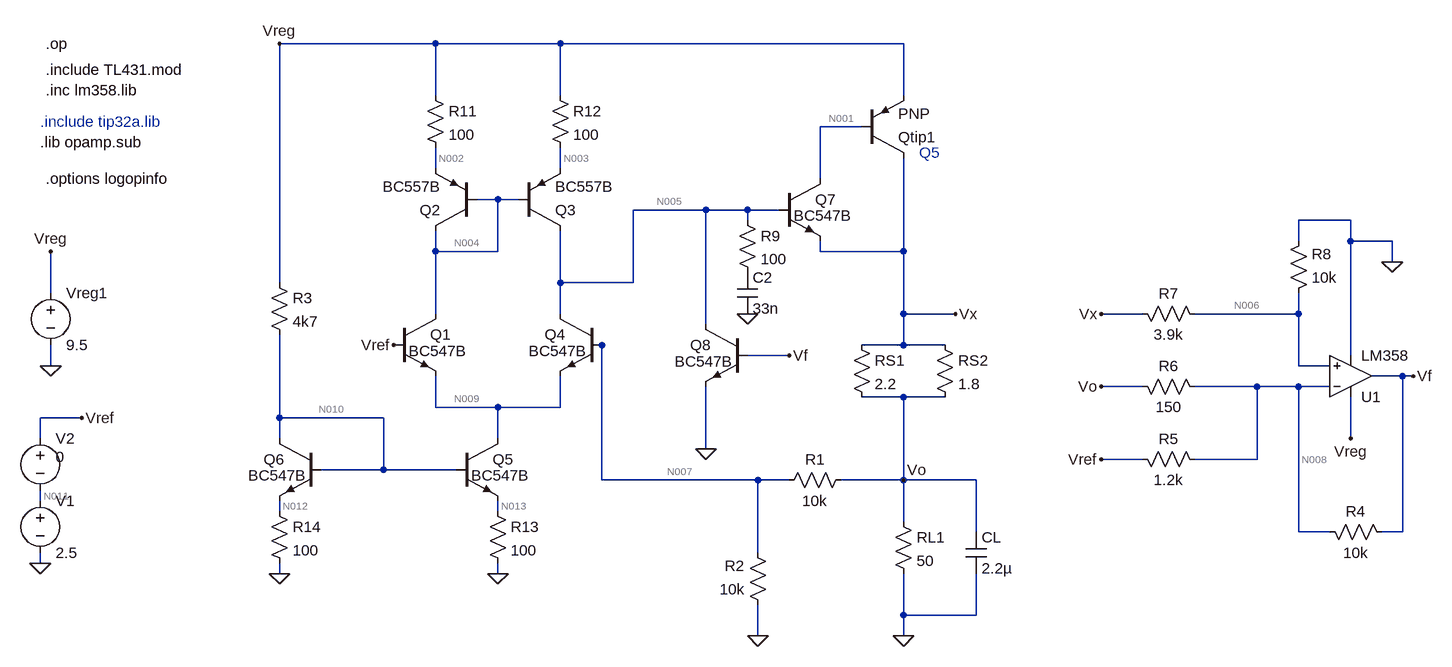
[diagram p0: schematic Analisis_termico.asc]
Analisis_termico.asc, the LTspice schematic file:
Version 4.1
SHEET 1 1620 680
WIRE -192 -368 -432 -368
WIRE 0 -368 -192 -368
WIRE 528 -368 0 -368
WIRE -192 -288 -192 -368
WIRE 0 -288 0 -368
WIRE 528 -288 528 -368
WIRE 464 -240 400 -240
WIRE -192 -176 -192 -208
WIRE 0 -176 0 -208
WIRE 400 -160 400 -240
WIRE -96 -128 -128 -128
WIRE -64 -128 -96 -128
WIRE 224 -112 112 -112
WIRE 288 -112 224 -112
WIRE 336 -112 288 -112
WIRE 288 -96 288 -112
WIRE 1216 -96 1136 -96
WIRE 1136 -64 1136 -96
WIRE 1216 -64 1216 -96
WIRE 1280 -64 1216 -64
WIRE -192 -48 -192 -80
WIRE -96 -48 -96 -128
WIRE -96 -48 -192 -48
WIRE 400 -48 400 -64
WIRE 528 -48 528 -192
WIRE 528 -48 400 -48
WIRE 1280 -32 1280 -64
WIRE -432 0 -432 -368
WIRE 0 0 0 -80
WIRE 112 0 112 -112
WIRE 112 0 0 0
WIRE -784 16 -784 -48
WIRE -192 48 -192 -48
WIRE 0 48 0 0
WIRE 528 48 528 -48
WIRE 608 48 528 48
WIRE 896 48 832 48
WIRE 1136 48 1136 16
WIRE 1136 48 976 48
WIRE 224 64 224 -112
WIRE 64 96 48 96
WIRE 528 96 528 48
WIRE 528 96 464 96
WIRE 592 96 528 96
WIRE 352 112 288 112
WIRE 1216 112 1216 -64
WIRE -784 128 -784 96
WIRE 1136 128 1136 48
WIRE 1184 128 1136 128
WIRE 1296 144 1248 144
WIRE 1312 144 1296 144
WIRE 896 160 832 160
WIRE 1072 160 976 160
WIRE 1136 160 1072 160
WIRE 1184 160 1136 160
WIRE 528 176 464 176
WIRE 592 176 528 176
WIRE -192 192 -192 144
WIRE -96 192 -192 192
WIRE 0 192 0 144
WIRE 0 192 -96 192
WIRE -736 208 -800 208
WIRE -432 208 -432 80
WIRE -272 208 -432 208
WIRE -800 240 -800 208
WIRE -432 240 -432 208
WIRE -96 240 -96 192
WIRE 1216 240 1216 176
WIRE 224 256 224 160
WIRE 896 272 832 272
WIRE 1072 272 1072 160
WIRE 1072 272 976 272
WIRE -272 288 -272 208
WIRE -272 288 -368 288
WIRE -160 288 -272 288
WIRE 64 304 64 96
WIRE 304 304 64 304
WIRE 352 304 304 304
WIRE 528 304 528 176
WIRE 528 304 432 304
WIRE 640 304 528 304
WIRE -800 336 -800 320
WIRE -432 352 -432 336
WIRE -96 352 -96 336
WIRE 528 368 528 304
WIRE 640 384 640 304
WIRE 1136 384 1136 160
WIRE 1184 384 1136 384
WIRE 1296 384 1296 144
WIRE 1296 384 1264 384
WIRE 304 416 304 304
WIRE -800 432 -800 416
WIRE -432 448 -432 432
WIRE -96 448 -96 432
WIRE 528 512 528 448
WIRE 640 512 640 448
WIRE 640 512 528 512
WIRE 304 544 304 496
WIRE 528 544 528 512
FLAG -96 448 0
FLAG -432 448 0
FLAG 528 544 0
FLAG 304 544 0
FLAG -256 96 Vref
FLAG -784 128 0
FLAG -784 -48 Vreg
FLAG -432 -368 Vreg
FLAG 528 304 Vo
FLAG 608 48 Vx
FLAG 224 256 0
FLAG 352 112 Vf
FLAG 1312 144 Vf
FLAG 832 272 Vref
FLAG 832 160 Vo
FLAG 832 48 Vx
FLAG 1216 240 Vreg
FLAG -800 432 0
FLAG -736 208 Vref
FLAG 1280 -32 0
FLAG 288 48 0
SYMBOL npn -256 48 R0
WINDOW 3 23 57 Left 2
SYMATTR Value BC547B
SYMATTR InstName Q1
SYMBOL pnp -128 -80 R180
SYMATTR InstName Q2
SYMATTR Value BC557B
SYMBOL res 448 288 R90
WINDOW 0 0 56 VBottom 2
WINDOW 3 32 56 VTop 2
SYMATTR InstName R1
SYMATTR Value 10k
SYMBOL res 320 512 R180
WINDOW 0 36 76 Left 2
WINDOW 3 36 40 Left 2
SYMATTR InstName R2
SYMATTR Value 10k
SYMBOL res -448 -16 R0
SYMATTR InstName R3
SYMATTR Value 4k7
SYMBOL voltage -784 0 R0
WINDOW 123 0 0 Left 0
WINDOW 39 0 0 Left 0
SYMATTR InstName Vreg1
SYMATTR Value 9.5
SYMBOL res 512 352 R0
SYMATTR InstName RL1
SYMATTR Value 50
SYMBOL pnp 464 -192 M180
SYMATTR InstName Qtip1
SYMBOL res 448 80 R0
SYMATTR InstName RS1
SYMATTR Value 2.2
SYMBOL res 1280 400 M270
WINDOW 0 32 56 VTop 2
WINDOW 3 0 56 VBottom 2
SYMATTR InstName R4
SYMATTR Value 10k
SYMBOL res 992 288 M270
WINDOW 0 32 56 VTop 2
WINDOW 3 0 56 VBottom 2
SYMATTR InstName R5
SYMATTR Value 1.2k
SYMBOL res 992 176 M270
WINDOW 0 32 56 VTop 2
WINDOW 3 0 56 VBottom 2
SYMATTR InstName R6
SYMATTR Value 150
SYMBOL res 992 64 M270
WINDOW 0 32 56 VTop 2
WINDOW 3 0 56 VBottom 2
SYMATTR InstName R7
SYMATTR Value 3.9k
SYMBOL res 1120 32 M180
WINDOW 0 36 76 Left 2
WINDOW 3 36 40 Left 2
SYMATTR InstName R8
SYMATTR Value 10k
SYMBOL OpAmps\\opamp2 1216 208 M180
SYMATTR InstName U1
SYMATTR Value LM358
SYMBOL pnp -64 -80 M180
SYMATTR InstName Q3
SYMATTR Value BC557B
SYMBOL npn 64 48 M0
WINDOW 3 23 57 Left 2
SYMATTR Value BC547B
SYMATTR InstName Q4
SYMBOL npn -160 240 R0
WINDOW 3 23 57 Left 2
SYMATTR Value BC547B
SYMATTR InstName Q5
SYMBOL npn -368 240 M0
WINDOW 3 23 57 Left 2
SYMATTR Value BC547B
SYMATTR InstName Q6
SYMBOL npn 336 -160 R0
WINDOW 3 23 57 Left 2
SYMATTR Value BC547B
SYMATTR InstName Q7
SYMBOL npn 288 64 M0
WINDOW 3 23 57 Left 2
SYMATTR Value BC547B
SYMATTR InstName Q8
SYMBOL res -112 336 R0
SYMATTR InstName R13
SYMATTR Value 100
SYMBOL res -448 336 R0
SYMATTR InstName R14
SYMATTR Value 100
SYMBOL res -208 -304 R0
SYMATTR InstName R11
SYMATTR Value 100
SYMBOL res -16 -304 R0
SYMATTR InstName R12
SYMATTR Value 100
SYMBOL voltage -800 320 R0
WINDOW 123 0 0 Left 0
WINDOW 39 0 0 Left 0
SYMATTR InstName V1
SYMATTR Value 2.5
SYMBOL cap 272 -16 R0
SYMATTR InstName C2
SYMATTR Value 33n
SYMBOL voltage -800 224 R0
WINDOW 123 0 0 Left 0
WINDOW 39 0 0 Left 0
WINDOW 3 24 44 Left 2
SYMATTR InstName V2
SYMATTR Value 0
SYMBOL cap 624 384 R0
SYMATTR InstName CL
SYMATTR Value 2.2µ
SYMBOL res 272 -112 R0
SYMATTR InstName R9
SYMATTR Value 100
SYMBOL res 576 80 R0
SYMATTR InstName RS2
SYMATTR Value 1.8
TEXT -800 -248 Left 2 ;.include tip32a.lib
TEXT -800 -216 Left 2 !.lib opamp.sub
TEXT -792 -296 Left 2 !.inc lm358.lib
TEXT -792 -328 Left 2 !.include TL431.mod
TEXT 552 -200 Left 2 ;Q5
TEXT -792 -368 Left 2 !.op
TEXT -792 -160 Left 2 !.options logopinfo

The netlist it stands for:
* Analisis_termico.asc
Q1 N004 Vref N009 0 BC547B
Q2 N004 N004 N002 0 BC557B
R1 Vo N007 10k
R2 0 N007 10k
R3 Vreg N010 4k7
Vreg1 Vreg 0 9.5
RL1 Vo 0 50
Qtip1 Vx N001 Vreg 0 PNP
RS1 Vx Vo 2.2
R4 Vf N008 10k
R5 N008 Vref 1.2k
R6 N008 Vo 150
R7 N006 Vx 3.9k
R8 N006 0 10k
X§U1 N006 N008 Vreg 0 Vf LM358  ; pins In+ In- V+ V- OUT
Q3 N005 N004 N003 0 BC557B
Q4 N005 N007 N009 0 BC547B
Q5 N009 N010 N013 0 BC547B
Q6 N010 N010 N012 0 BC547B
Q7 N001 N005 Vx 0 BC547B
Q8 N005 Vf 0 0 BC547B
R13 N013 0 100
R14 N012 0 100
R11 Vreg N002 100
R12 Vreg N003 100
V1 N011 0 2.5
C2 P001 0 33n
V2 Vref N011 0
CL Vo 0 2.2µ
R9 N005 P001 100
RS2 Vx Vo 1.8
.model NPN NPN
.model PNP PNP
.lib standard.bjt
* .include tip32a.lib
.lib opamp.sub
.inc lm358.lib
.include TL431.mod
* Q5
.op
.options logopinfo
.backanno
.end

* Results of the author's LTspice run, read from the files saved beside the schematic
* Operating Point:
*   V(vref) = 2.5 V
*   V(n002) = 9.41 V
*   V(vo) = 5.035 V
*   V(vreg) = 9.5 V
*   V(n001) = 8.606 V
*   V(n008) = 4.691 V
*   V(n006) = 3.699 V
*   V(n003) = 9.407 V
*   V(n011) = 2.5 V
*   V(n004) = 8.786 V
*   V(n009) = 1.866 V
*   V(n007) = 2.502 V
*   V(n010) = 838.9 mV
*   V(vx) = 5.137 V
*   V(vf) = 70.27 mV
*   V(n005) = 5.775 V
*   V(n013) = 184 mV
*   V(n012) = 183.6 mV
*   V(p001) = 5.775 V
*   I(Vreg1) = -107.2 mA
*   I(R5) = 1.826 mA
*   I(CL) = 0 A
*   Ic(Q1) = 904.3 µA
*   Ib(Q1) = 2.904 µA
*   Ie(Q1) = -907.2 µA
*   Is(Q1) = 0 A
*   I(R8) = 369.9 µA
*   Ic(Q5) = 1.834 mA
*   Ib(Q5) = 6.421 µA
*   Ie(Q5) = -1.84 mA
*   Is(Q5) = 0 A
*   Ic(Q8) = 6.156 pA
*   Ib(Q8) = -5.682 pA
*   Ie(Q8) = -473.5 fA
*   Is(Q8) = 0 A
*   I(V1) = 1.823 mA
*   I(R1) = 253.3 µA
*   Ic(Qtip1) = -102.6 mA
*   Ib(Qtip1) = -1.026 mA
*   Ie(Qtip1) = 103.6 mA
*   Is(Qtip1) = 0 A
*   I(R3) = 1.843 mA
*   I(R7) = -368.8 µA
*   Ic(Q7) = 1.026 mA
*   Ib(Q7) = 3.474 µA
*   Ie(Q7) = -1.029 mA
*   Is(Q7) = 0 A
*   I(R14) = 1.836 mA
*   I(RS2) = 56.78 mA
*   I(V2) = 1.823 mA
*   I(R12) = 929.4 µA
*   Ic(Q2) = -899 µA
*   Ib(Q2) = -2.779 µA
*   Ie(Q2) = 901.8 µA
*   Is(Q2) = 0 A
*   I(R4) = -462.1 µA
*   I(R13) = 1.84 mA
*   I(R9) = 0 A
*   I(RL1) = 100.7 mA
*   Ic(Q4) = 923.4 µA
*   Ib(Q4) = 3.104 µA
*   Ie(Q4) = -926.5 µA
*   Is(Q4) = 0 A
*   I(R2) = -250.2 µA
*   I(RS1) = 46.45 mA
*   I(R6) = -2.289 mA
*   I(R11) = 901.8 µA
*   Ic(Q3) = -926.9 µA
*   Ib(Q3) = -2.501 µA
*   Ie(Q3) = 929.4 µA
*   Is(Q3) = 0 A
*   Ic(Q6) = 1.83 mA
*   Ib(Q6) = 6.515 µA
*   Ie(Q6) = -1.836 mA
*   Is(Q6) = 0 A
*   I(C2) = 0 A
*   Ix(u1:1) = -1.088 µA
*   Ix(u1:2) = 997.6 nA
*   Ix(u1:99) = -94.55 µA
*   Ix(u1:50) = -367.4 µA
*   Ix(u1:28) = 462.1 µA
* From the log:
*   Semiconductor Device Operating Points:
*                           --- Diodes ---
*   Name:     u1:D1       u1:D2       u1:D5       u1:D3       u1:D6
*   Model:      dx          dx          dx          dx          dx
*   Id:     -7.87e-12    5.10e-05    4.64e-04   -3.44e-13    2.25e-06
*   Vd:     -7.87e+00    6.38e-01    6.95e-01   -3.43e-01    5.57e-01
*   Req:     1.00e+12    5.07e+02    5.57e+01    1.00e+12    1.15e+04
*   CAP:     0.00e+00    0.00e+00    0.00e+00    0.00e+00    0.00e+00
*   Name:     u1:D4
*   Model:      dx
*   Id:     -1.98e-13
*   Vd:     -1.97e-01
*   Req:     1.00e+12
*   CAP:     0.00e+00
*                           --- Bipolar Transistors ---
*   Name:      Qtip1         Q1          Q4          Q5          Q6
*   Model:      pnp        bc547b      bc547b      bc547b      bc547b
*   Ib:      -1.03e-03    2.90e-06    3.10e-06    6.42e-06    6.52e-06
*   Ic:      -1.03e-01    9.04e-04    9.23e-04    1.83e-03    1.83e-03
*   Vbe:     -8.94e-01    6.34e-01    6.35e-01    6.55e-01    6.55e-01
*   Vbc:      3.47e+00   -6.29e+00   -3.27e+00   -1.03e+00    0.00e+00
*   Vce:     -4.36e+00    6.92e+00    3.91e+00    1.68e+00    6.55e-01
*   BetaDC:   1.00e+02    3.11e+02    2.97e+02    2.86e+02    2.81e+02
*   Gm:       3.97e+00    3.44e-02    3.51e-02    6.93e-02    6.91e-02
*   Rpi:      2.52e+01    9.01e+03    8.43e+03    4.07e+03    4.01e+03
*   Rx:       0.00e+00    1.00e+00    1.00e+00    1.00e+00    1.00e+00
*   Ro:       4.62e+72    7.51e+04    7.03e+04    3.42e+04    3.37e+04
*   Cbe:      0.00e+00    5.84e-11    5.95e-11    8.33e-11    8.34e-11
*   Cbc:      0.00e+00    1.00e-12    1.20e-12    1.59e-12    2.31e-12
*   Cjs:      0.00e+00    0.00e+00    0.00e+00    0.00e+00    0.00e+00
*   BetaAC:   1.00e+02    3.10e+02    2.96e+02    2.82e+02    2.77e+02
*   Cbx:      0.00e+00    6.17e-13    7.37e-13    9.75e-13    1.42e-12
*   Ft:       0.00e+00    9.13e+07    9.10e+07    1.28e+08    1.26e+08
*   Name:        Q7          Q8          Q2          Q3        u1:Q1
*   Model:     bc547b      bc547b      bc557b      bc557b        qx
*   Ib:       3.47e-06   -5.68e-12   -2.78e-06   -2.50e-06    4.97e-12
*   Ic:       1.03e-03    6.16e-12   -8.99e-04   -9.27e-04   -4.69e-12
*   Vbe:      6.38e-01    7.03e-02   -6.24e-01   -6.21e-01    2.76e-01
*   Vbc:     -2.83e+00   -5.70e+00    0.00e+00    3.01e+00    4.69e+00
*   Vce:      3.47e+00    5.78e+00   -6.24e-01   -3.63e+00   -4.42e+00
*   BetaDC:   2.95e+02   -1.08e+00    3.23e+02    3.71e+02   -9.44e-01
*   Gm:       3.90e-02    1.47e-11    3.40e-02    3.51e-02    8.97e-20
*   Rpi:      7.53e+03    6.39e+11    9.48e+03    1.05e+04    1.00e+12
*   Rx:       1.00e+00    1.00e+00    1.00e+00    1.00e+00    0.00e+00
*   Ro:       6.29e+04    1.79e+14    2.30e+04    2.56e+04    1.52e+93
*   Cbe:      6.26e-11    1.41e-11    5.13e-11    5.17e-11    0.00e+00
*   Cbc:      1.25e-12    1.03e-12    6.80e-12    2.01e-12    0.00e+00
*   Cjs:      0.00e+00    0.00e+00    0.00e+00    0.00e+00    0.00e+00
*   BetaAC:   2.94e+02    9.42e+00    3.23e+02    3.70e+02    8.97e-08
*   Cbx:      7.65e-13    6.34e-13    4.02e-12    1.19e-12    0.00e+00
*   Ft:       9.61e+07    1.48e-01    8.72e+07    1.02e+08    0.00e+00
*   Name:      u1:Q2
*   Model:       qx
*   Ib:      -8.99e-08
*   Ic:      -9.99e-05
*   Vbe:     -7.15e-01
*   Vbc:      3.65e+00
*   Vce:     -4.36e+00
*   BetaDC:   1.11e+03
*   Gm:       3.86e-03
*   Rpi:      2.88e+05
*   Rx:       0.00e+00
*   Ro:       4.79e+75
*   Cbe:      0.00e+00
*   Cbc:      0.00e+00
*   Cjs:      0.00e+00
*   BetaAC:   1.11e+03
*   Cbx:      0.00e+00
*   Ft:       0.00e+00